# Altium schematic sheet HandshakeIRemitter.SchDoc
size A
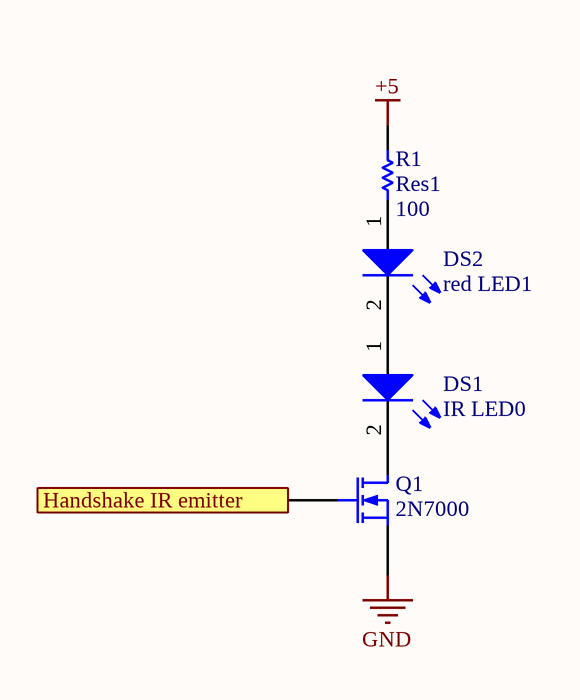
[diagram p0: HandshakeIRemitter.SchDoc]

## Parts
DS1  IR LED0  [LED-0]
DS2  red LED1  [LED-1]
Q1  2N7000  [BCY-W3/D5]
R1  Res1  value 100  [AXIAL-0.3]

## Ports
Handshake IR emitter

## Nets
+5: R1.1
GND: Q1.1(S)
Handshake IR emitter: Q1.2(G) ; port Handshake IR emitter
NetDS1_1: DS1.1(A) DS2.2(K)

Not connected (* = marked no-connect by the designer): DS1 2(K); DS2 1(A); Q1 3(D); R1 2

## Library data of the parts
DS1 = LED0: Typical INFRARED GaAs LED; Manufacturer: Generic Components; Class: Optoelectronic; Published: 08/06/2000; Publisher: Altium Hobart Technology Centre; SubClass: LED
DS2 = LED1: Typical RED GaAs LED; Manufacturer: Generic Components; Class: Optoelectronic; Published: 08/06/2000; Publisher: Altium Hobart Technology Centre; SubClass: LED
Q1 = 2N7000: N-Channel Enhancement Mode Vertical DMOS FET; Manufacturer: Zetex; Class: Discrete; SubClass: MOSFET - Low Power; Published: 8/06/2000; Publisher: Altium Hobart Technology Centre
R1 = Res1: Resistor; Manufacturer: Generic Components; Class: Passive; Published: 08/06/2000; Publisher: Altium Hobart Technology Centre; SubClass: Resistor